# Altium schematic sheet KCInput_Attenuator_V0.1.SchDoc
size A4
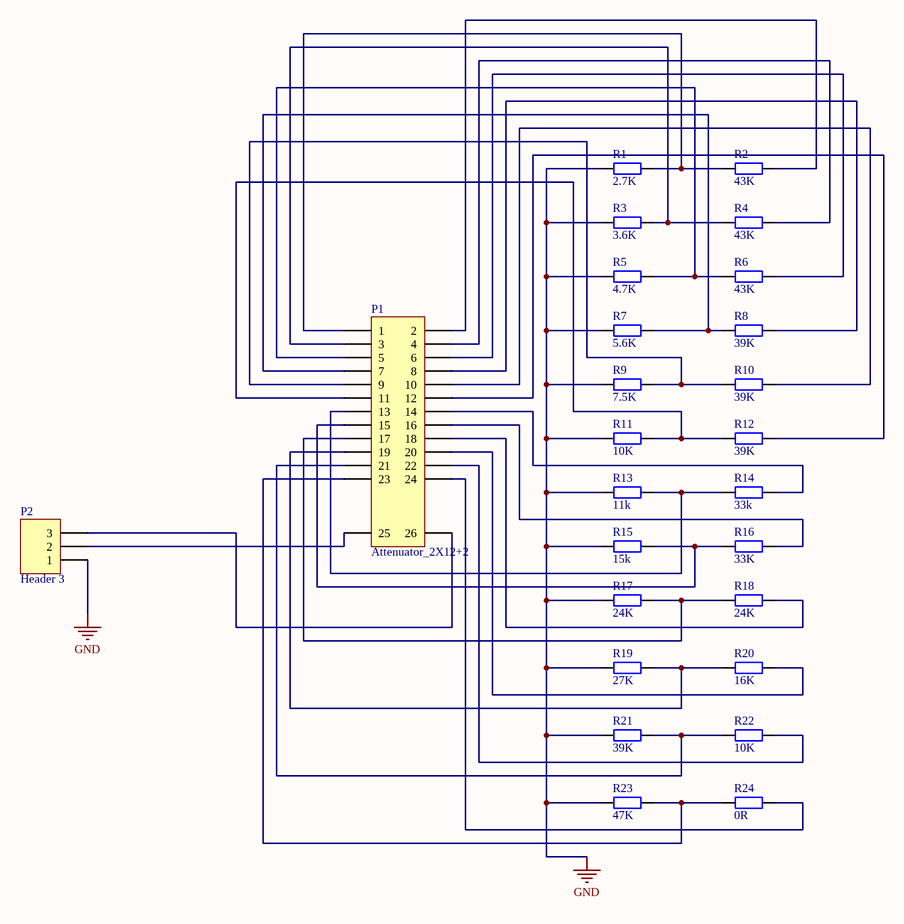
[diagram p0: KCInput_Attenuator_V0.1.SchDoc]

## Parts
P1  Attenuator_2X12+2  [Attenuator_2X13]
P2  Header 3  [HDR1X3]
R1  2.7K  [RS 1/4W]
R2  43K  [RS 1/4W]
R3  3.6K  [RS 1/4W]
R4  43K  [RS 1/4W]
R5  4.7K  [RS 1/4W]
R6  43K  [RS 1/4W]
R7  5.6K  [RS 1/4W]
R8  39K  [RS 1/4W]
R9  7.5K  [RS 1/4W]
R10  39K  [RS 1/4W]
R11  10K  [RS 1/4W]
R12  39K  [RS 1/4W]
R13  11k  [RS 1/4W]
R14  33k  [RS 1/4W]
R15  15k  [RS 1/4W]
R16  33K  [RS 1/4W]
R17  24K  [RS 1/4W]
R18  24K  [RS 1/4W]
R19  27K  [RS 1/4W]
R20  16K  [RS 1/4W]
R21  39K  [RS 1/4W]
R22  10K  [RS 1/4W]
R23  47K  [RS 1/4W]
R24  0R  [RS 1/4W]

## Nets
GND: P2.1 R1.1 R3.1 R5.1 R7.1 R9.1 R11.1 R13.1 R15.1 R17.1 R19.1 R21.1 R23.1
NetP1_1: P1.1 R1.2 R2.1
NetP1_2: P1.2 R2.2
NetP1_3: P1.3 R3.2 R4.1
NetP1_4: P1.4 R4.2
NetP1_5: P1.5 R5.2 R6.1
NetP1_6: P1.6 R6.2
NetP1_7: P1.7 R7.2 R8.1
NetP1_8: P1.8 R8.2
NetP1_9: P1.9 R9.2 R10.1
NetP1_10: P1.10 R10.2
NetP1_11: P1.11 R11.2 R12.1
NetP1_12: P1.12 R12.2
NetP1_13: P1.13 R13.2 R14.1
NetP1_14: P1.14 R14.2
NetP1_15: P1.15 R15.2 R16.1
NetP1_16: P1.16 R16.2
NetP1_17: P1.17 R17.2 R18.1
NetP1_18: P1.18 R18.2
NetP1_19: P1.19 R19.2 R20.1
NetP1_20: P1.20 R20.2
NetP1_21: P1.21 R21.2 R22.1
NetP1_22: P1.22 R22.2
NetP1_23: P1.23 R23.2 R24.1
NetP1_24: P1.24 R24.2
NetP1_25: P1.25 P2.2
NetP1_26: P1.26 P2.3

## Library data of the parts
P1 = Attenuator_2X12+2: Attenuator  12-Pin, Dual row, 2 Out; LatestRevisionDate: 17-Jul-2002; LatestRevisionNote: Re-released for DXP Platform.; Publisher: Altium Limited
P2 = Header 3: Header, 3-Pin; LatestRevisionDate: 17-Jul-2002; LatestRevisionNote: Re-released for DXP Platform.; Publisher: Altium Limited
R1-R24 = R-CRR: 直插色环电阻; BOM名称: 色环电阻; 版权归属: 源创客; 学习资源: www.ooocke.com